# Altium project Hydrogen Bike BMS (100V).PrjPcb (part 2 of 3)

## Sheet AFE.SchDoc
size A; SheetNumber: 5; SheetTotal: 9
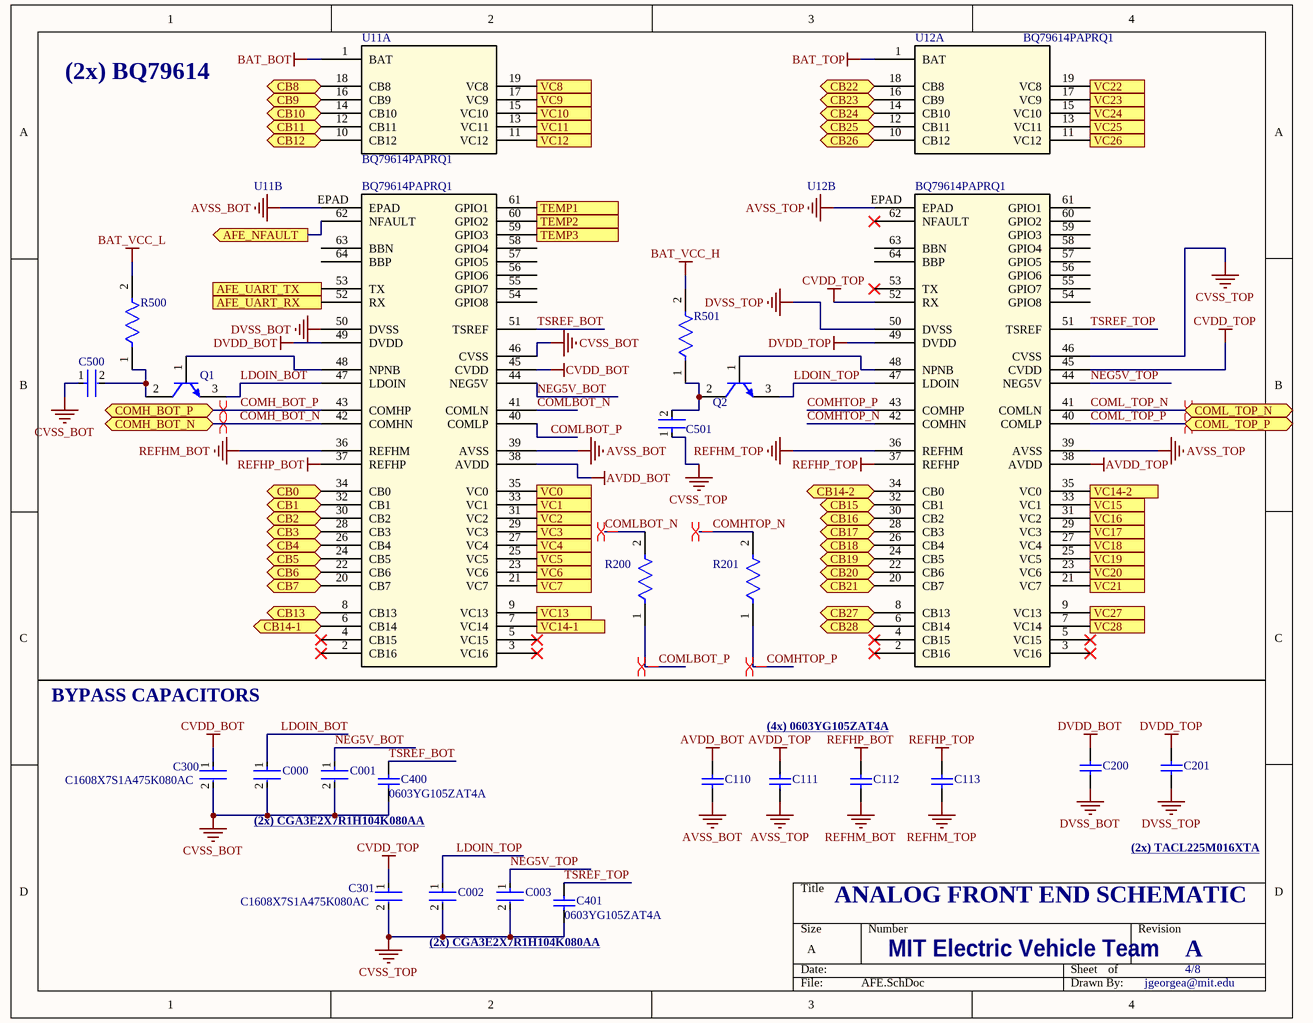
[diagram p4: AFE.SchDoc]

### Parts
C000  CGA3E2X7R1H104K080AA  [FP-CGA3E-0_3-0_1-IPC_A]  (value not drawn)
C001  CGA3E2X7R1H104K080AA  [FP-CGA3E-0_3-0_1-IPC_A]  (value not drawn)
C002  CGA3E2X7R1H104K080AA  [FP-CGA3E-0_3-0_1-IPC_A]  (value not drawn)
C003  CGA3E2X7R1H104K080AA  [FP-CGA3E-0_3-0_1-IPC_A]  (value not drawn)
C110  0603YG105ZAT4A  [CAPC1608X90X35ML15T15]  (value not drawn)
C111  0603YG105ZAT4A  [CAPC1608X90X35ML15T15]  (value not drawn)
C112  0603YG105ZAT4A  [CAPC1608X90X35ML15T15]  (value not drawn)
C113  0603YG105ZAT4A  [CAPC1608X90X35ML15T15]  (value not drawn)
C200  TACL225M016XTA  [CAPC1609X100X15ML20]  (value not drawn)
C201  TACL225M016XTA  [CAPC1609X100X15ML20]  (value not drawn)
C300  C1608X7S1A475K080AC  [FP-C1608-080-MFG]
C301  C1608X7S1A475K080AC  [FP-C1608-080-MFG]
C400  0603YG105ZAT4A  [CAPC1608X90X35ML15T15]
C401  0603YG105ZAT4A  [CAPC1608X90X35ML15T15]
C500  C0805C224J1RACTU  [FP-C0805C-DN-MFG]  (value not drawn)
C501  C0805C224J1RACTU  [FP-C0805C-DN-MFG]  (value not drawn)
Q1  2SC3646T-TD-E  [ONSC-SOT-89_PCP-1-3-419AU_V]  (value not drawn)
Q2  2SC3646T-TD-E  [ONSC-SOT-89_PCP-1-3-419AU_V]  (value not drawn)
R200  RC1608J102CS  [FP-RC1608-IPC_A]  (value not drawn)
R201  RC1608J102CS  [FP-RC1608-IPC_A]  (value not drawn)
R500  PCAN1206E1500BST5  [FP-PCAN1206-MFG]  (value not drawn)
R501  PCAN1206E1500BST5  [FP-PCAN1206-MFG]  (value not drawn)
U11  BQ79614PAPRQ1  [QFP_4PAPRQ1_TEX]  (parts A,B of 2)
U12  BQ79614PAPRQ1  [QFP_4PAPRQ1_TEX]  (parts A,B of 2)

### Ports
AFE_NFAULT (out, see BMS_top_level[2C], Communication[1C]), AFE_UART_RX (in, see BMS_top_level[2C], Communication[1C]), AFE_UART_TX (out, see BMS_top_level[2C], Communication[1B]), CB0 (bidir, see BMS_top_level[2A], Cell_Balancing[2A]), CB1 (bidir, see BMS_top_level[2A], Cell_Balancing[2A]), CB2 (bidir, see BMS_top_level[2A], Cell_Balancing[2A]), CB3 (bidir, see BMS_top_level[2A], Cell_Balancing[2B]), CB4 (bidir, see BMS_top_level[2A], Cell_Balancing[2B]), CB5 (bidir, see BMS_top_level[2A], Cell_Balancing[2B]), CB6 (bidir, see BMS_top_level[2A], Cell_Balancing[2C]), CB7 (bidir, see BMS_top_level[2A], Cell_Balancing[2C]), CB8 (bidir, see BMS_top_level[2A], Cell_Balancing[2C]), CB9 (bidir, see BMS_top_level[2A], Cell_Balancing[2D]), CB10 (bidir, see BMS_top_level[2A], Cell_Balancing[2D]), CB11 (bidir, see BMS_top_level[2A], Cell_Balancing[3A]), CB12 (bidir, see BMS_top_level[2A], Cell_Balancing[3A]), CB13 (bidir, see BMS_top_level[2A], Cell_Balancing[3A]), CB14-1 (bidir, see BMS_top_level[2B], Cell_Balancing[3B]), CB14-2 (bidir, see BMS_top_level[2B], Cell_Balancing[3B]), CB15 (bidir, see BMS_top_level[2B], Cell_Balancing[3B]), CB16 (bidir, see BMS_top_level[2B], Cell_Balancing[3C]), CB17 (bidir, see BMS_top_level[2B], Cell_Balancing[3C]), CB18 (bidir, see BMS_top_level[2B], Cell_Balancing[3C]), CB19 (bidir, see BMS_top_level[2B], Cell_Balancing[3D]), CB20 (bidir, see BMS_top_level[2B], Cell_Balancing[3D]), CB21 (bidir, see BMS_top_level[2B], Cell_Balancing[4A]), CB22 (bidir, see BMS_top_level[2B], Cell_Balancing[4A]), CB23 (bidir, see BMS_top_level[2B], Cell_Balancing[4A]), CB24 (bidir, see BMS_top_level[2B], Cell_Balancing[4B]), CB25 (bidir, see BMS_top_level[2B], Cell_Balancing[4B]), CB26 (bidir, see BMS_top_level[2B], Cell_Balancing[4B]), CB27 (bidir, see BMS_top_level[2B], Cell_Balancing[4C]), CB28 (bidir, see BMS_top_level[2B], Cell_Balancing[4C]), COMH_BOT_N (bidir, see BMS_top_level[2C], Communication[1B]), COMH_BOT_P (bidir, see BMS_top_level[2C], Communication[1A]), COML_TOP_N (bidir, see BMS_top_level[2C], Communication[3B]), COML_TOP_P (bidir, see BMS_top_level[2C], Communication[3A]), TEMP1 (in, see BMS_top_level[2B], Connectors#1[1C]), TEMP2 (in, see BMS_top_level[2B], Connectors#1[1C]), TEMP3 (in, see BMS_top_level[2B], Connectors#1[1C]), VC0 (in, see BMS_top_level[2C], Voltage_Sensing[1A]), VC1 (in, see BMS_top_level[2C], Voltage_Sensing[1A]), VC2 (in, see BMS_top_level[2C], Voltage_Sensing[1A]), VC3 (in, see BMS_top_level[2C], Voltage_Sensing[1B]), VC4 (in, see BMS_top_level[2C], Voltage_Sensing[1B]), VC5 (in, see BMS_top_level[2C], Voltage_Sensing[1B]), VC6 (in, see BMS_top_level[2C], Voltage_Sensing[1C]), VC7 (in, see BMS_top_level[2C], Voltage_Sensing[1C]), VC8 (in, see BMS_top_level[2C], Voltage_Sensing[1C]), VC9 (in, see BMS_top_level[2C], Voltage_Sensing[1D]), VC10 (in, see BMS_top_level[2C], Voltage_Sensing[1D]), VC11 (in, see BMS_top_level[2C], Voltage_Sensing[3A]), VC12 (in, see BMS_top_level[2C], Voltage_Sensing[3A]), VC13 (in, see BMS_top_level[2C], Voltage_Sensing[3A]), VC14-1 (in, see BMS_top_level[2C], Voltage_Sensing[3B]), VC14-2 (in, see BMS_top_level[2C], Voltage_Sensing[3B]), VC15 (in, see BMS_top_level[2D], Voltage_Sensing[3B]), VC16 (in, see BMS_top_level[2D], Voltage_Sensing[3C]), VC17 (in, see BMS_top_level[2D], Voltage_Sensing[3C]), VC18 (in, see BMS_top_level[2D], Voltage_Sensing[3C]), VC19 (in, see BMS_top_level[2D], Voltage_Sensing[3D]), VC20 (in, see BMS_top_level[2D], Voltage_Sensing[3D]), VC21 (in, see BMS_top_level[2D], Voltage_Sensing[4A]), VC22 (in, see BMS_top_level[2D], Voltage_Sensing[4A]), VC23 (in, see BMS_top_level[2D], Voltage_Sensing[4A]), VC24 (in, see BMS_top_level[2D], Voltage_Sensing[4B]), VC25 (in, see BMS_top_level[2D], Voltage_Sensing[4B]), VC26 (in, see BMS_top_level[2D], Voltage_Sensing[4B]), VC27 (in, see BMS_top_level[2D], Voltage_Sensing[4C]), VC28 (in, see BMS_top_level[2D], Voltage_Sensing[4C])

### Nets
AVDD_BOT: C110.2 U11.38(AVDD)
AVDD_TOP: C111.2 U12.38(AVDD)
AVSS_BOT: C000.2 C001.2 C110.1 C112.1 C200.2 C300.2 C400.1 C500.1 U11.36(REFHM) U11.39(AVSS) U11.46(CVSS) U11.50(DVSS) U11.EPAD  [also labelled CVSS_BOT, DVSS_BOT, REFHM_BOT]
AVSS_TOP: C002.2 C003.2 C111.1 C113.1 C201.2 C301.2 C401.1 C501.1 U12.36(REFHM) U12.39(AVSS) U12.46(CVSS) U12.50(DVSS) U12.EPAD  [also labelled CVSS_TOP, DVSS_TOP, REFHM_TOP]
BAT_BOT: U11.1(BAT)
BAT_TOP: U12.1(BAT)
BAT_VCC_H: R501.2
BAT_VCC_L: R500.2
CVDD_BOT: C300.1 U11.45(CVDD)
CVDD_TOP: C301.1 U12.45(CVDD) U12.52(RX)
DVDD_BOT: C200.1 U11.49(DVDD)
DVDD_TOP: C201.1 U12.49(DVDD)
REFHP_BOT: C112.2 U11.37(REFHP)
REFHP_TOP: C113.2 U12.37(REFHP)
AFE_NFAULT: U11.62(NFAULT) ; port AFE_NFAULT
AFE_UART_N: U11.52(RX) ; port AFE_UART_RX
AFE_UART_P: U11.53(TX) ; port AFE_UART_TX
CB11: U11.12(CB11) ; port CB11
CB21: U12.20(CB7) ; port CB21
COMH_BOT_N: U11.42(COMHN) ; port COMH_BOT_N
COMH_BOT_P: U11.43(COMHP) ; port COMH_BOT_P
COMHTOP_N: R201.2 U12.42(COMHN)
COMHTOP_P: R201.1 U12.43(COMHP)
COML_TOP_N: U12.41(COMLN) ; port COML_TOP_N
COML_TOP_P: U12.40(COMLP) ; port COML_TOP_P
COMLBOT_N: R200.2 U11.41(COMLN)
COMLBOT_P: R200.1 U11.40(COMLP)
LDOIN_BOT: C000.1 Q1.3(E) U11.47(LDOIN)
LDOIN_TOP: C002.1 Q2.3(E) U12.47(LDOIN)
NEG5V_BOT: C001.1 U11.44(NEG5V)
NEG5V_TOP: C003.1 U12.44(NEG5V)
TSREF_BOT: C400.2 U11.51(TSREF)
TSREF_TOP: C401.2 U12.51(TSREF)
VC11: U11.13(VC11) ; port VC11
VC21: U12.21(VC7) ; port VC21
NetC21_1: U11.32(CB1) ; port CB1
NetC21_2: U11.34(CB0) ; port CB0
NetC22_1: U11.30(CB2) ; port CB2
NetC23_1: U11.28(CB3) ; port CB3
NetC24_1: U11.26(CB4) ; port CB4
NetC25_1: U11.24(CB5) ; port CB5
NetC26_1: U11.22(CB6) ; port CB6
NetC27_1: U11.20(CB7) ; port CB7
NetC28_1: U11.18(CB8) ; port CB8
NetC29_1: U11.16(CB9) ; port CB9
NetC30_1: U11.14(CB10) ; port CB10
NetC32_1: U11.10(CB12) ; port CB12
NetC33_1: U11.8(CB13) ; port CB13
NetC34_1: U11.6(CB14) ; port CB14-1
NetC61_1: U12.32(CB1) ; port CB15
NetC61_2: U12.34(CB0) ; port CB14-2
NetC62_1: U12.30(CB2) ; port CB16
NetC63_1: U12.28(CB3) ; port CB17
NetC64_1: U12.26(CB4) ; port CB18
NetC65_1: U12.24(CB5) ; port CB19
NetC66_1: U12.22(CB6) ; port CB20
NetC68_1: U12.18(CB8) ; port CB22
NetC70_1: U12.16(CB9) ; port CB23
NetC71_1: U12.14(CB10) ; port CB24
NetC72_1: U12.12(CB11) ; port CB25
NetC73_1: U12.10(CB12) ; port CB26
NetC74_1: U12.8(CB13) ; port CB27
NetC75_1: U12.6(CB14) ; port CB28
NetC80_1: U11.35(VC0) ; port VC0
NetC81_1: U11.33(VC1) ; port VC1
NetC82_1: U11.31(VC2) ; port VC2
NetC83_1: U11.29(VC3) ; port VC3
NetC84_1: U11.27(VC4) ; port VC4
NetC85_1: U11.25(VC5) ; port VC5
NetC86_1: U11.23(VC6) ; port VC6
NetC87_1: U11.21(VC7) ; port VC7
NetC88_1: U11.19(VC8) ; port VC8
NetC89_1: U11.17(VC9) ; port VC9
NetC90_1: U11.15(VC10) ; port VC10
NetC92_1: U11.11(VC12) ; port VC12
NetC93_1: U11.9(VC13) ; port VC13
NetC94_1: U11.7(VC14) ; port VC14-1
NetC95_1: U12.35(VC0) ; port VC14-2
NetC96_1: U12.33(VC1) ; port VC15
NetC97_1: U12.31(VC2) ; port VC16
NetC98_1: U12.29(VC3) ; port VC17
NetC99_1: U12.27(VC4) ; port VC18
NetC100_1: U12.25(VC5) ; port VC19
NetC101_1: U12.23(VC6) ; port VC20
NetC103_1: U12.19(VC8) ; port VC22
NetC104_1: U12.17(VC9) ; port VC23
NetC105_1: U12.15(VC10) ; port VC24
NetC106_1: U12.13(VC11) ; port VC25
NetC107_1: U12.11(VC12) ; port VC26
NetC108_1: U12.9(VC13) ; port VC27
NetC109_1: U12.7(VC14) ; port VC28
NetC500_2: C500.2 Q1.2(C) R500.1
NetC501_2: C501.2 Q2.2(C) R501.1
NetP1_1: U11.61(GPIO1) ; port TEMP1
NetP1_2: U11.60(GPIO2) ; port TEMP2
NetP1_3: U11.59(GPIO3) ; port TEMP3
NetQ1_1: Q1.1(B) U11.48(NPNB)
NetQ2_1: Q2.1(B) U12.48(NPNB)

Not connected (* = marked no-connect by the designer): U11 2(CB16)* 3(VC16)* 4(CB15)* 5(VC15)* 54(GPIO8) 55(GPIO7) 56(GPIO6) 57(GPIO5) 58(GPIO4) 63(BBN) 64(BBP); U12 2(CB16)* 3(VC16)* 4(CB15)* 5(VC15)* 53(TX)* 54(GPIO8) 55(GPIO7) 56(GPIO6) 57(GPIO5) 58(GPIO4) 59(GPIO3) 60(GPIO2) 61(GPIO1) 62(NFAULT)* 63(BBN) 64(BBP)

### Layout directives
differential pair: COMH_BOT_N, COMH_BOT_P, COMHTOP_N, COMHTOP_P, COML_TOP_N, COML_TOP_P, COMLBOT_N, COMLBOT_P

### Notes on the sheet
- (2x) BQ79614
- BYPASS CAPACITORS
- (4x) 0603YG105ZAT4A
- (2x) CGA3E2X7R1H104K080AA
- ANALOG FRONT END SCHEMATIC
- (2x) TACL225M016XTA
- MIT Electric Vehicle Team
- A
- 4/8
- jgeorgea@mit.edu

### Library data of the parts
C000 C001 C002 C003 = CMP-2000-07546-2: as C41 on sheet Communication; Weight: 7.1E-05oz; Composition: Ceramic; Max Operating Temperature: 125°C; Termination: SMD/SMT; Dielectric: X7R; Length: 1.6mm; Package Quantity: 1; REACH SVHC: No SVHC; Lead Free: Lead Free; Case Code (Metric): 1608; Min Operating Temperature: -55°C; Packaging: Tape and Reel; Tolerance: 10%; Voltage Rating: 50V; Case Code (Imperial): 0603; Capacitance: 100nF; Case/Package: 0603; Voltage Rating (DC): 50V; Depth: 0.8mm; Radiation Hardening: No; Ratings: AEC-Q200; Mount: Surface Mount; Voltage: 50V; Thickness: 0.035inch; Width: 0.8mm; Height: 0.8mm
C110-C113 C400 C401 = CMP-2006-04543-1: Manufacturer: AVX Interconnect / Elco; Part Number: 0603YG105ZAT4A
C200 C201 = CMP-2006-00199-1: Manufacturer: AVX Interconnect / Elco; Part Number: TACL225M016XTA
C300 C301 = CMP-08246-005491-1: CAP CER 4.7UF 10V X7S 0603; Dielectric Material: Ceramic; Interface: I2C; Frequency: 48MHz; Memory Type: FLASH; Peripherals: Brown-out Detect/Reset; Tolerance: 10%; Oscillator Type: Internal; Number of I/Os: 53; Core Architecture: ARM; Memory Size: 64KB; Voltage Rating: 10V; Lead Free: Lead Free; Case Code (Imperial): 0603; Voltage Rating (DC): 10V; Series: Leopard Gecko; Min Operating Temperature: -40°C; Case/Package: LFBGA; Dielectric: X7S; RoHS Compliant: Yes; Package Quantity: 1000; Capacitance: 4.7uF; Thickness: 800um; Number of Pins: 64; REACH SVHC: No SVHC; Length: 1.6mm; Max Operating Temperature: 125°C; Depth: 0.8mm; Packaging: Tape and Reel; Case Code (Metric): 1608
C500 C501 = CMP-1036-04559-3: CAP CER 0.22UF 100V 5% X7R 0805; Manufacturer: KEMET; Tolerance: 0.05; Value: 0.22 μF; Temperature Coefficient: 30ppm/°C; Material: Ceramic; ComponentLink2URL: https://content.kemet.com/datasheets/KEM_C1003_C0G_SMD.pdf; Voltage Rating: 100 V; Temperature Range High: +125°C; Ipc Land Pattern Name: CAPC200125X78; Device Class L2: Capacitors; Temperature Range Low: -55°C; Automotive: No; RoHS: TRUE; ComponentLink2Description: Datasheet; Digikey Description: CAP CER 0.22UF 100V 5% X7R 0805; Category: Cap; Package: C0805C-DN; Temperature: -55°C to +125°C; Capacitance: 0.22 μF; Mouser Description: Multilayer Ceramic Capacitors MLCC - SMD/SMT 100volts 0.22uF X7R 5%; Temperature Characteristic: X7R; Device Class L1: Passive Components; Height: 0.88mm; Device Class L3: Ceramic Capacitors; Lead Free: Yes; Manufacturer Part Number: C0805C224J1RACTU; Octopart: https://octopart.com/c0805c224j1ractu-kemet-17138221
Q1 Q2 = CMP-1048-00948-1: Bipolar Transistor, 100 V, 1 A, Low VCE(sat), NPN Single, 3-Pin SOT-89, Pb-Free, Tape and Reel; Manufacturer: On Semiconductor; IC Continuous (A): 1; PartNumber: 2SC3646T-TD-E; RoHS: TRUE; Packing: Tape and Reel; ComponentLink2URL: http://www.onsemi.com/pub_link/Collateral/EN2005-D.PDF; ComponentLink3URL: http://www.onsemi.com/pub_link/Collateral/ENA1087-D.PDF; PackageReference: SOT-89_PCP-1-3-419AU; Mounting Technology: Surface Mount; ComponentLink1Description: Manufacturer URL; ComponentLink3Description: Package Specification; ComponentLink1URL: http://www.onsemi.com/; PackageDescription: 3-Pin Small Outline Transistor, Body 4.5 x 2.5 mm, Pitch 1.5 mm; Polarity: NPN; PackageVersion: Rev. O, 04/2012; ComponentLink2Description: Datasheet
R200 R201 = CMP-13261-002301-1: Res Thick Film 0603 1kΩ 5% 0.1W ±100ppm/°C Molded SMD T/R; Power Rating: 100mW; Resistance: 1kR; Voltage Rating (DC): 50V; Contact Plating: Tin; Mount: Surface Mount; Number of Terminations: 2; Features: Moisture Resistant; Max Power Dissipation: 100mW; Military Standard: Not; Case/Package: 0603; Radiation Hardening: No; Temperature Coefficient: 100ppm/°C; Length: 1.6mm; Height: 0.022inch; Case Code (Metric): 1608; Max Operating Temperature: 155°C; Composition: Thick Film; Tolerance: 5%; Width: 0.031inch; Depth: 0.8mm; Packaging: Tape and Reel; Lead Free: Lead Free; Case Code (Imperial): 0603; Min Operating Temperature: -55°C
R500 R501 = CMP-02407-000005-1: RES SMD 150 OHM 0.1% 2W 1206; Manufacturer: Vishay; Value: 150Ω; Temperature Coefficient: 25ppm/°C; Power Rating: 2000mW; Voltage Rating: 100V; Category: Res; Lead Free: Yes; Manufacturer Part Number: PCAN1206E1500BST5; Digikey Description: RES SMD 150 OHM 0.1% 2W 1206; Device Class L2: Resistors; Ipc Land Pattern Name: RESC320160X38; Package: PCAN1206; Tolerance: 0.1%; Temperature Range High: +155°C; Resistance: 150Ω; Composition: Thin Film; Series: PCAN; ComponentLink2URL: https://www.vishay.com/docs/60125/pcan.pdf; Octopart: https://octopart.com/pcan1206e1500bst5-vishay-47198091; RoHS: TRUE; Height: 0.018inch; Temperature Range Low: -55°C; Temperature: -55°C to +155°C; Device Class L1: Passive Components; Automotive: No; Device Class L3: Chip SMD Resistors; ComponentLink2Description: Datasheet
U11 U12 = BQ79614PAPRQ1: No Description Available; Mfr_Name: Texas Instruments; RefDes: RefDes; Type: Type

## Sheet Power.SchDoc
size A; SheetNumber: 4; SheetTotal: 9
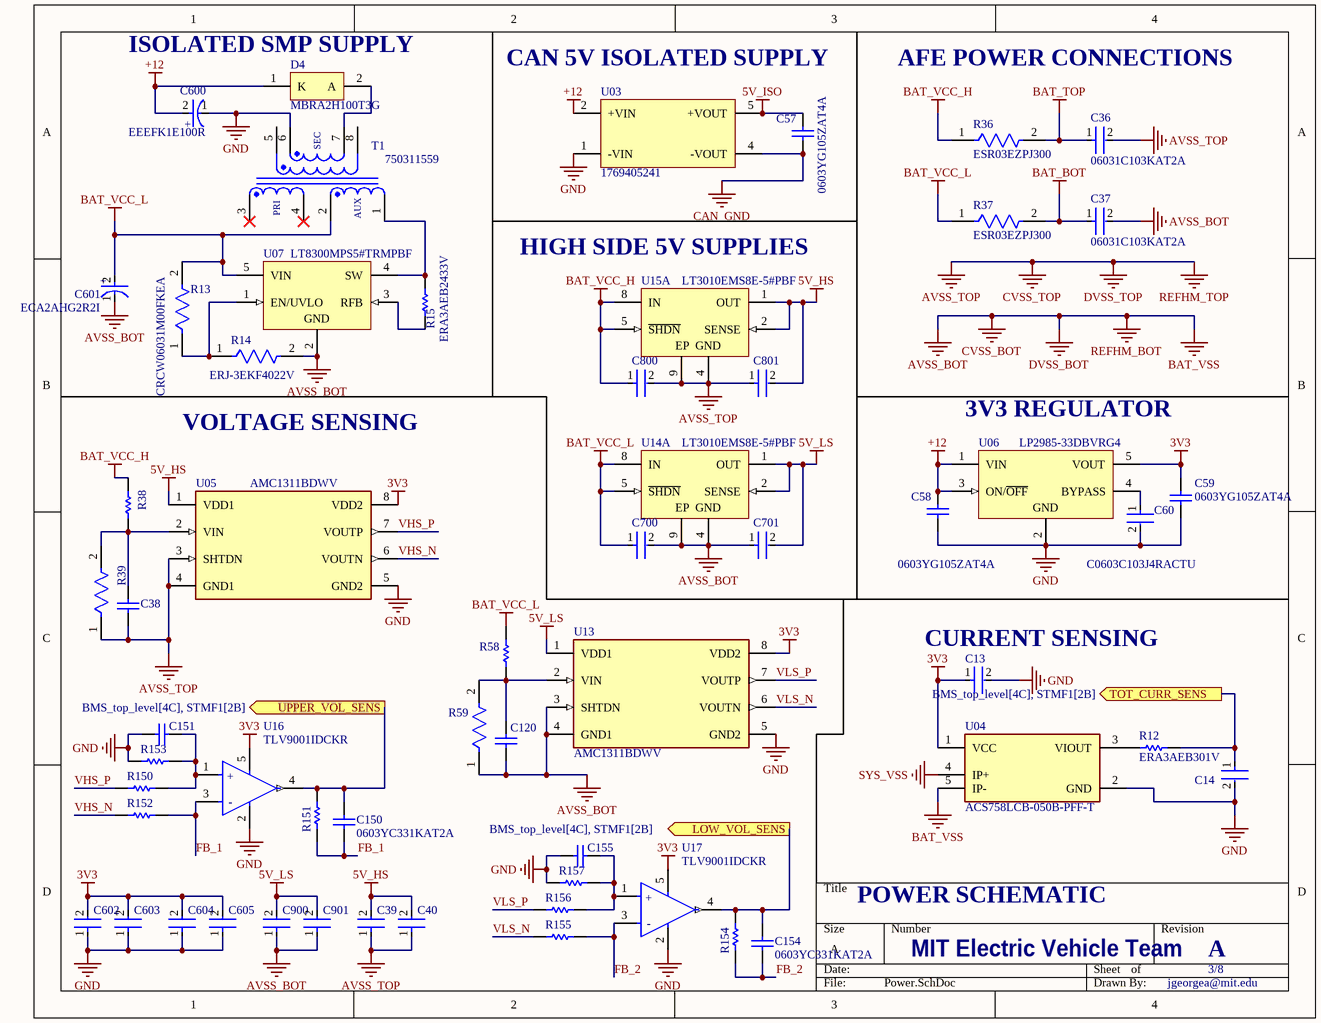
[diagram p5: Power.SchDoc]

### Parts
C13  CGA3E2X7R1H104K080AA  [FP-CGA3E-0_3-0_1-IPC_A]  (value not drawn)
C14  CGA3E2X7R1H104K080AA  [FP-CGA3E-0_3-0_1-IPC_A]  (value not drawn)
C36  06031C103KAT2A  [FP-0603-L_1_6_0_15-W_0_81-IPC_C]
C37  06031C103KAT2A  [FP-0603-L_1_6_0_15-W_0_81-IPC_C]
C38  CC0603JRNPO9BN101  [CAPC1608X90X40ML10T20]  (value not drawn)
C39  C2012X7S2A105K125AE  [FP-C2012-125-IPC_B]  (value not drawn)
C40  CGA3E2X7R1H104K080AA  [FP-CGA3E-0_3-0_1-IPC_A]  (value not drawn)
C57  0603YG105ZAT4A  [CAPC1608X90X35ML15T15]
C58  0603YG105ZAT4A  [CAPC1608X90X35ML15T15]
C59  0603YG105ZAT4A  [CAPC1608X90X35ML15T15]
C60  C0603C103J4RACTU  [FP-C0603C-CF-MFG]
C120  CC0603JRNPO9BN101  [CAPC1608X90X40ML10T20]  (value not drawn)
C150  0603YC331KAT2A  [CAPC1608X90X35ML15T15]
C151  0603YC331KAT2A  [CAPC1608X90X35ML15T15]  (value not drawn)
C154  0603YC331KAT2A  [CAPC1608X90X35ML15T15]
C155  0603YC331KAT2A  [CAPC1608X90X35ML15T15]  (value not drawn)
C600  EEEFK1E100R  [FP-FKB-MFG]
C601  ECA2AHG2R2I  [FP-RAD-TH-D_5_0_5-L_11_1-MFG]
C602  C2012X7S2A105K125AE  [FP-C2012-125-IPC_B]  (value not drawn)
C603  C2012X7S2A105K125AE  [FP-C2012-125-IPC_B]  (value not drawn)
C604  CGA3E2X7R1H104K080AA  [FP-CGA3E-0_3-0_1-IPC_A]  (value not drawn)
C605  CGA3E2X7R1H104K080AA  [FP-CGA3E-0_3-0_1-IPC_A]  (value not drawn)
C700  C2012X7S2A105K125AE  [FP-C2012-125-IPC_B]  (value not drawn)
C701  C2012X7S2A105K125AE  [FP-C2012-125-IPC_B]  (value not drawn)
C800  C2012X7S2A105K125AE  [FP-C2012-125-IPC_B]  (value not drawn)
C801  C2012X7S2A105K125AE  [FP-C2012-125-IPC_B]  (value not drawn)
C900  C2012X7S2A105K125AE  [FP-C2012-125-IPC_B]  (value not drawn)
C901  CGA3E2X7R1H104K080AA  [FP-CGA3E-0_3-0_1-IPC_A]  (value not drawn)
D4  MBRA2H100T3G  [ONSC-SMA-2-403D-02_V]
R12  ERA3AEB301V  [RESC1608X55X30LL20T20]
R13  CRCW06031M00FKEA  [FP-CRCW0603-e3-MFG]
R14  ERJ-3EKF4022V  [FP-ERJ3EK-IPC_C]
R15  ERA3AEB2433V  [RESC1608X55X30NL20T20]
R36  ESR03EZPJ300  [FP-ESR03-MFG]
R37  ESR03EZPJ300  [FP-ESR03-MFG]
R38  ERJ-3GEYJ245V  [RESC1608X55X30ML15T15]  (value not drawn)
R39  RT0603FRE0739K2L  [FP-RT0603-MFG]  (value not drawn)
R58  ERJ-3GEYJ245V  [RESC1608X55X30ML15T15]  (value not drawn)
R59  RT0603FRE0739K2L  [FP-RT0603-MFG]  (value not drawn)
R150  ERJ-3EKF3301V  [RESC1609X55X30ML15T15]  (value not drawn)
R151  ERJ-3EKF3301V  [RESC1609X55X30ML15T15]  (value not drawn)
R152  ERJ-3EKF3301V  [RESC1609X55X30ML15T15]  (value not drawn)
R153  ERJ-3EKF3301V  [RESC1609X55X30ML15T15]  (value not drawn)
R154  ERJ-3EKF3301V  [RESC1609X55X30ML15T15]  (value not drawn)
R155  ERJ-3EKF3301V  [RESC1609X55X30ML15T15]  (value not drawn)
R156  ERJ-3EKF3301V  [RESC1609X55X30ML15T15]  (value not drawn)
R157  ERJ-3EKF3301V  [RESC1609X55X30ML15T15]  (value not drawn)
T1  750311559  [WE-FLYLT_EP7_L9.78W9.50H10.54]
U03  1769405241  [WPME-FISM_SMT-8_L13.2W11.4H7.25]
U04  ACS758LCB-050B-PFF-T  [FP-CB-5-PFF-MFG]
U05  AMC1311BDWV  [FP-DWV0008A-MFG]
U06  LP2985-33DBVRG4  [DBV0005A_M]
U07  LT8300MPS5#TRMPBF  [LT-S5-5-TSOT-23_N]
U13  AMC1311BDWV  [FP-DWV0008A-MFG]
U14  LT3010EMS8E-5#PBF  [LT-MS8E-8-1880X1680TP_L]  (part A of 2)
U15  LT3010EMS8E-5#PBF  [LT-MS8E-8-1880X1680TP_L]  (part A of 2)
U16  TLV9001IDCKR  [FP-DCK0005A-MFG]
U17  TLV9001IDCKR  [FP-DCK0005A-MFG]

### Ports
LOW_VOL_SENS (out, see BMS_top_level[4C], STMF1[2B]), TOT_CURR_SENS (out, see BMS_top_level[4C], STMF1[2B]), UPPER_VOL_SENS (out, see BMS_top_level[4C], STMF1[2B])

### Nets
3V3: C13.1 C59.2 C602.2 C603.2 C604.2 C605.2 U04.1(VCC) U05.8(VDD2) U06.5(VOUT) U13.8(VDD2) U16.5(V+) U17.5(V+)
5V_HS: C39.2 C40.2 C801.2 U05.1(VDD1) U15.1(OUT) U15.2(SENSE)
5V_ISO: C57.2 U03.5(+VOUT)
5V_LS: C701.2 C900.2 C901.2 U13.1(VDD1) U14.1(OUT) U14.2(SENSE)
+12: C58.2 C600.2(A) D4.1(K) U03.2(+VIN) U06.1(VIN) U06.3(ON/~{OFF})
AVSS_BOT: C37.2 C120.1 C601.1(C) C700.2 C701.1 C900.1 C901.1 R14.2 R59.1 U04.5(IP-) U07.2(GND) U13.3(SHTDN) U13.4(GND1) U14.4(GND) U14.9(EP)  [also labelled BAT_VSS, CVSS_BOT, DVSS_BOT, REFHM_BOT]
AVSS_TOP: C36.2 C38.1 C39.1 C40.1 C800.2 C801.1 R39.1 U05.3(SHTDN) U05.4(GND1) U15.4(GND) U15.9(EP)  [also labelled CVSS_TOP, DVSS_TOP, REFHM_TOP]
BAT_BOT: C37.1 R37.2
BAT_TOP: C36.1 R36.2
BAT_VCC_H: C800.1 R36.1 R38.2 U15.5(~{SHDN}) U15.8(IN)
BAT_VCC_L: C601.2(A) C700.1 R13.2 R37.1 R58.2 T1.2 U07.5(VIN) U14.5(~{SHDN}) U14.8(IN)
CAN_GND: C57.1 U03.4(-VOUT)
GND: C13.2 C14.2 C58.1 C59.1 C60.2 C151.1 C155.1 C600.1(C) C602.1 C603.1 C604.1 C605.1 R153.2 R157.2 T1.6 U03.1(-VIN) U04.2(GND) U05.5(GND2) U06.2(GND) U13.5(GND2) U16.2(V-) U17.2(V-)
SYS_VSS: U04.4(IP+)
FB_1: C150.1 R151.1 R152.1 U16.3(IN-)
FB_2: C154.1 R154.1 R155.1 U17.3(IN-)
LOW_VOL: C154.2 R154.2 U17.4(OUT) ; port LOW_VOL_SENS
TOT_CURR: C14.1 R12.2 ; port TOT_CURR_SENS
UPPER_VOL: C150.2 R151.2 U16.4(OUT) ; port UPPER_VOL_SENS
VHS_N: R152.2 U05.6(VOUTN)
VHS_P: R150.2 U05.7(VOUTP)
VLS_N: R155.2 U13.6(VOUTN)
VLS_P: R156.2 U13.7(VOUTP)
NetC38_2: C38.2 R38.1 R39.2 U05.2(VIN)
NetC60_1: C60.1 U06.4(BYPASS)
NetC120_2: C120.2 R58.1 R59.2 U13.2(VIN)
NetC151_2: C151.2 R150.1 R153.1 U16.1(IN+)
NetC155_2: C155.2 R156.1 R157.1 U17.1(IN+)
NetD4_2: D4.2(A) T1.7
NetR12_1: R12.1 U04.3(VIOUT)
NetR13_1: R13.1 R14.1 U07.1(EN/UVLO)
NetR15_1: R15.1 U07.3(RFB)
NetR15_2: R15.2 T1.1 U07.4(SW)

Not connected (* = marked no-connect by the designer): T1 3* 4* 5 8

### Notes on the sheet
- (near D4) ISOLATED SMP SUPPLY
- CAN 5V ISOLATED SUPPLY
- AFE POWER CONNECTIONS
- (near U15) HIGH SIDE 5V SUPPLIES
- VOLTAGE SENSING
- (near U06) 3V3 REGULATOR
- (near C13) CURRENT SENSING
- POWER SCHEMATIC
- MIT Electric Vehicle Team
- A
- 3/8
- jgeorgea@mit.edu
- (in symbol CMP-03913-24618066-1) SEC; PRI; AUX
- (in symbol CMP-04895-000186-1) +; -
- (in symbol CMP-05427-000055-1) +
- (in symbol CMP-05427-001174-1) +

### Library data of the parts
C13 C14 C40 C604 C605 C901 = CMP-2000-07546-2: Cap Ceramic 100nF 50V X7R 10% Pad SMD 0603 +125°C Automotive T/R; Weight: 7.1E-05oz; Composition: Ceramic; Max Operating Temperature: 125°C; Termination: SMD/SMT; Dielectric: X7R; Length: 1.6mm; Package Quantity: 1; REACH SVHC: No SVHC; Lead Free: Lead Free; Case Code (Metric): 1608; Min Operating Temperature: -55°C; Packaging: Tape and Reel; Tolerance: 10%; Voltage Rating: 50V; Case Code (Imperial): 0603; Capacitance: 100nF; Case/Package: 0603; Voltage Rating (DC): 50V; Depth: 0.8mm; Radiation Hardening: No; Ratings: AEC-Q200; Mount: Surface Mount; Voltage: 50V; Thickness: 0.035inch; Width: 0.8mm; Height: 0.8mm
C36 C37 = CMP-2006-04074-2: General Purpose Ceramic Capacitor, 0603, 10nF, 10%, X7R, 15%, 100V; Dissipation Factor: 2.5%; Insulation Resistance: 100GR; Voltage: 100V; Series: -; Case Code (Imperial): 0603; Mount: Surface Mount; Dielectric: X7R; Package Quantity: 1; Construction: Flat; Max Operating Temperature: 125°C; Tolerance: 10%; RoHS Compliant: Yes; Case/Package: 0603; Contact Plating: Tin; Height: 0.9mm; Voltage Rating: 100V; Depth: 0.81mm; Radiation Hardening: No; Termination: SMD/SMT; Case Code (Metric): 1608; Number of Pins: 2; Length: 1.6mm; Lead Free: Lead Free; Thickness: 0.035inch; Packaging: Tape and Reel; Capacitance: 10nF; Width: 0.032inch; Min Operating Temperature: -55°C; Voltage Rating (DC): 100V; REACH SVHC: No SVHC
C38 C120 = CMP-2100-03594-1: Chip Capacitor, 100 pF, +/- 5%, 50 V, -55 to 125 degC, 0603 (1608 Metric), RoHS, Tape and Reel; Manufacturer: Yageo; Capacitance: 100pF; Voltage Rating (DC): 50V; Dielectric: C0G; Temperature Coefficient: 30ppm/degC; Insulation Resistance: 100GR; Datasheet Version: Rev. 14, 07/2016; Manufacturer URL: http://www.yageo.com/; Packaging: TapeandReel; Mount: SurfaceMount; RoHSCompliant: True; Package Reference: 0603; Tolerance: 5%; Max Operating Temperature: 125degC; Case Code (Imperial): 0603; Number of Pins: 2; Width: 0.8mm; Case Code (Metric): 1608; Voltage: 50V; REACH SVHC: Unknown; Package Description: 2-Pin Surface Mount Device, Body 1.6 x 0.8 mm; Composition: Ceramic; Lead Free: LeadFree; Min Operating Temperature: -55degC; Radiation Hardening: No; Depth: 0.8mm; Thickness: 0.035inch; Datasheet URL: http://www.yageo.com/documents/recent/UPY-GP_NP0_16V-to-50V_14.pdf; Termination: SMD/SMT; Package Quantity: 1; Length: 1.6mm; Voltage Rating: 50V; Height: 0.8mm; Case/Package: 0603
C39 C602 C603 C700 C701 C800 C801 C900 = CMP-08246-004333-1: CAP CER 1UF 100V X7S 0805; Tolerance: 10%; Case Code (Metric): 2012; Resistor Type: Ceramic; Voltage Rating (DC): 100V; RoHS Compliant: Yes; Mount: Surface Mount; Min Operating Temperature: -55°C; Voltage Rating: 100V; Series: C; Width: 0.05inch; Max Operating Temperature: 125°C; Height: 1.25mm; Capacitance: 1uF; Length: 2mm; Dielectric: X7S; Case/Package: 0805; Packaging: Tape and Reel; Features: Soft Termination; Lead Free: Lead Free; Case Code (Imperial): 0805; Thickness: 0.049inch; Termination: SMD/SMT; Package Quantity: 1; Depth: 1.25mm
C57-C59 = CMP-2006-04543-1: Manufacturer: AVX Interconnect / Elco; Part Number: 0603YG105ZAT4A
C60 = CMP-2006-03033-2: CAP CER 10000PF 16V 5% X7R 0603; Manufacturer: KEMET; Value: 10,000 pF; Tolerance: 0.05; Material: Ceramic; Temperature Coefficient: 30ppm/°C; Automotive Grade: Grade 1; Height: 0.87mm; Temperature Range High: +125°C; Temperature Range Low: -55°C; Automotive: Yes; Package: C0603C-CF; Temperature Characteristic: X7R; RoHS: TRUE; Device Class L2: Capacitors; Device Class L3: Ceramic Capacitors; Device Class L1: Passive Components; Manufacturer Part Number: C0603C103J4RACTU; Voltage Rating: 16 V; ComponentLink2URL: https://api.kemet.com/component-edge/download/datasheet/C0603C100J5GACAUTO.pdf; ComponentLink2Description: Datasheet; Mouser Description: Multilayer Ceramic Capacitors MLCC - SMD/SMT 16volts 10000pF X7R 5%; Temperature: -55°C to +125°C; Digikey Description: CAP CER 10000PF 16V 5% X7R 0603; Octopart: https://octopart.com/c0603c103j4ractu-kemet-9139447; Capacitance: 10,000 pF; Category: Cap; Lead Free: Yes
C150 C151 C154 C155 = CMP-2006-04513-1: Manufacturer: AVX Interconnect / Elco; Part Number: 0603YC331KAT2A
C600 = CMP-05427-000055-1: CAP ALUM 10UF 20% 25V SMD; ESR (Equivalent Series Resistance): 1.35R; Life (Hours): 2000Hour; Dielectric Material: Aluminium; Leakage Current: 3uA; Ripple Current (AC): 90mA; Polarity: Polar; Voltage: 25V; Voltage Rating: 25V; Number of Pins: 2; Package Quantity: 1; Max Operating Temperature: 105°C; Tolerance: 20%; Voltage Rating (DC): 25V; Packaging: Tape and Reel; Impedance: 1.35R; Case/Package: Radial; Series: FK; Height - Seated (Max): 0.24inch; Diameter: 4mm; Length: 5.8mm; Construction: Cylindrical; Height: 5.8mm; Mount: Surface Mount; REACH SVHC: No SVHC; Termination: SMD/SMT; Capacitance: 10uF; Lead Free: Lead Free; RoHS Compliant: Yes; Contact Plating: Tin; Width: 5.5mm; Radiation Hardening: No; Min Operating Temperature: -55°C; Ripple Current: 90mA
C601 = CMP-05427-001174-1: Aluminum Electrolytic Capacitors (Radial Lead Type) AEC-Q200 Qualified 2.2uF ±20% 100V; Lead Diameter: 0.5mm; Life (Hours): 1000Hour; Lead/Base Style: Straight; Ripple Current: 21mA; Mount: Through Hole; Max Operating Temperature: 105°C; Length: 11mm; Voltage Rating (DC): 100V; Case/Package: Radial; Package Quantity: 2000; Lead Pitch: 2.5mm; Series: NHG; Min Operating Temperature: -55°C; Tolerance: 20%; Capacitance: 2.2uF; RoHS Compliant: Yes; Termination: Radial; Packaging: Ammo Pack; Height: 11mm; Diameter: 5mm; Radiation Hardening: No
D4 = CMP-1055-00325-1: Schottky Power Rectifier, 2-Pin SMA, Pb-Free, Tape and Reel; Manufacturer: On Semiconductor; IFSM Max (A): 130; Configuration: Single; PackageDescription: 2-Pin Small Molded Package, J-Bend Lead, Body 2.605 x 4.315 mm; ComponentLink2URL: http://www.onsemi.cn/pub_link/Collateral/MBRS2H100-D.PDF; RoHS: TRUE; ComponentLink3URL: http://www.onsemi.com/pub_link/Collateral/403D-02.PDF; PartNumber: MBRA2H100T3G; ComponentLink2Description: Datasheet; ComponentLink3Description: Package Specification; PackageReference: SMA-2-403D-02; ComponentLink1Description: Manufacturer URL; DatasheetVersion: Rev. 8; ComponentLink1URL: http://www.onsemi.com/; PackageVersion: Rev. G, 07/2012; Mounting Technology: Surface Mount; Packing: Tape and Reel
R12 = CMP-2000-00025-1: Manufacturer: Panasonic; Part Number: ERA3AEB301V
R13 = CMP-2000-03013-2: RES Thick Film, 1MΩ, 1%, 0.1W, 100ppm/°C, 0603; Max Power Dissipation: 100mW; Resistance: 1MR; Voltage Rating (DC): 75V; Depth: 0.85mm; Max Operating Temperature: 155°C; Length: 1.55mm; Power Rating: 100mW; Military Standard: Not; Features: Automotive AEC-Q200; Min Operating Temperature: -55°C; Number of Pins: 2; Mount: Surface Mount; Package Quantity: 10; Packaging: Tape and Reel; Height: 0.45mm; Radiation Hardening: No; Case Code (Metric): 1608; Temperature Coefficient: 100ppm/°C; Width: 0.85mm; Composition: Thick Film; Termination: SMD/SMT; Tolerance: 1%; Number of Terminations: 2; Lead Free: Lead Free; Contact Plating: Tin; Case/Package: 0603; Weight: 7.1E-05oz; Voltage Rating: 75V; Case Code (Imperial): 0603
R14 = CMP-2000-00486-2: RES SMD 40.2K OHM 1% 1/10W 0603; Power Rating: 100mW; Resistance: 40.2kR; Voltage Rating: 75V; Temperature Coefficient: 100ppm/°C; Voltage Rating (DC): 50V; Military Standard: Not; Lead Free: Lead Free; Resistor Type: Thick Film; Weight: 7.1E-05oz; Resistance Tolerance: 1%; Number of Terminations: 2; Min Operating Temperature: -55°C; Depth: 0.8mm; Max Power Dissipation: 100mW; Length: 1.6mm; Case Code (Imperial): 0603; Max Operating Temperature: 155°C; Series: ERJ; Radiation Hardening: No; Features: Automotive AEC-Q200; Mount: Surface Mount; Package Quantity: 1; Packaging: Tape and Reel; Height: 0.45mm; Width: 0.031inch; RoHS Compliant: Yes; Case/Package: 0603; Tolerance: 1%; Contact Plating: Tin; Technology: THICK FILM; Construction: Rectangular; Case Code (Metric): 1608; Termination: SMD/SMT
R15 = CMP-2000-00968-1: Manufacturer: Panasonic; Part Number: ERA3AEB2433V
R36 R37 = CMP-08839-029539-1: 30Ω ±5% 0.25W 0603 Anti-Surge Chip Resistor AEC-Q200; Temperature Coefficient: 200ppm/°C; Max Power Dissipation: 250mW; Resistance: 30R; Case Code (Imperial): 0603; Case Code (Metric): 1608; Height: 0.022inch; Number of Terminations: 2; Max Operating Temperature: 155°C; Length: 0.063inch; Package Quantity: 5000; Features: Automotive AEC-Q200; Tolerance: 5%; Width: 0.031inch; RoHS Compliant: Yes; Packaging: Tape and Reel; Min Operating Temperature: -55°C; Resistor Type: Thick Film; Case/Package: 0603; Series: ESR
R38 R58 = CMP-2000-00756-1: Manufacturer: Panasonic; Part Number: ERJ-3GEYJ245V
R39 R59 = CMP-2000-04739-2: RES SMD 39.2K OHM 1% 1/10W 0603; Manufacturer: Yageo; Temperature Coefficient: 50 ppm/°C; Resistance: 39.2KΩ; Tolerance: 0.01; Voltage Rating: 75V; Value: 39.2KΩ; Power Rating: 0.1W; ComponentLink2Description: Datasheet; Manufacturer Part Number: RT0603FRE0739K2L; Device Class L1: Passive Components; Temperature Range Low: -55°C; Package: RT0603; ComponentLink2URL: http://www.yageo.com/documents/recent/PYu-RT_1-to-0.01_RoHS_L_9.pdf; Device Class L2: Resistors; Octopart: https://octopart.com/rt0603fre0739k2l-yageo-1367269; Automotive: No; Digikey Description: RES SMD 39.2K OHM 1% 1/10W 0603; Temperature: -55°C to +155°C; Category: Res; Series: RT; RoHS: TRUE; Temperature Range High: +155°C; Device Class L3: Chip SMD Resistors; Composition: Thin Film; Height: 0.55mm; Footprint Url: http://www.yageo.com/exep/pages/download/literatures/PYu-R_Mount_10.pdf; Mouser Description: Thin Film Resistors - SMD 1/10W 39.2K ohm 1% 50ppm; Lead Free: Yes; Ipc Land Pattern Name: RESC16080X45
R150-R157 = CMP-2000-00436-2: Chip Resistors, 3.3 KOhm, +/- 1%, 0.1 W, 0603 (1608 Metric), -55 to 155 degC, RoHS, Tape and Reel; Manufacturer: Panasonic; Max Power Dissipation: 100mW; Voltage Rating: 75V; Temperature Coefficient: 100ppm/degreesC; Datasheet Version: 42095.0; Width: 0.8mm; Mount: SurfaceMount; Radiation Hardening: No; Package URL: http://www.st.com/st-web-ui/static/active/en/resource/technical/document/datasheet/CD00001320.pdf; Depth: 0.8mm; Package Description: 2-Pin Surface Mount Device, Body 1.6 x 0.85 mm; Package Quantity: 1; Contact Plating: Tin; Length: 1.6mm; Max Operating Temperature: 155degC; RoHSCompliant: true; Datasheet URL: https://industrial.panasonic.com/cdbs/www-data/pdf/RDA0000/AOA0000C283.pdf; Height: 0.022inch; Military Standard: Not; Termination: SMD/SMT; Case Code (Metric): 1608; Composition: ThickFilm; Resistance: 3.3KOhm; Packaging: TapeandReel; Min Operating Temperature: -55degC; Case/Package: 0603; Voltage Rating (DC): 75V; Lead Free: LeadFree; Package Reference: 0603; Power Rating: 100mW; Manufacturer URL: http://www.panasonic.com/; Case Code (Imperial): 0603; REACH SVHC: NoSVHC; Number of Terminations: 2; Number of Pins: 2; Tolerance: 1%
T1 = CMP-03913-24618066-1: 750311559 Flyback Converters For For DC/DC Converters SMPS Transformer 1500Vrms Isolation 200 ~ 300kHz Surface; DC Resistance (DCR): 725mΩ; Inductance: 1.5µH; Power Rating: 3W; Height: 8.64mm; NexarPartId: 24618066; Height - Seated (Max): 10.54mm; Frequency: 300kHz; Max Operating Temperature: 125°C; RoHS: Compliant; Lead Free: Lead Free; Length: 9.77mm; Mount: Surface Mount; Width: 9.14mm; Termination: SMD/SMT; Min Operating Temperature: -40°C
U03 = CMP-03913-130378542-1: 1769405241 WPME-FISM Fixed Isolated SIP/SMT Module; Output Power: 2W; Max Output Voltage: 5V; Isolation Voltage: 3kV; Max Input Voltage: 13.2V; Output Current: 400mA; Min Input Voltage: 10.8V; Max Switching Frequency: 600kHz; NexarPartId: 130378542; Length: 13.2mm; Width: 11.4mm; Height: 7.25mm
U04 = CMP-82923-000254-1: SENSOR CURRENT HALL 50A AC/DC; Operating Supply Voltage: 5V; Max Supply Current: 13.5mA; Frequency: 120kHz; Quiescent Current: 10mA; Response Time: 4us; Sensitivity: 40mV/A; Output Current: 1mA; Linearity: 1%; Polarity: Bidirectional; Accuracy: 2%; Number of Channels: 1; Max Supply Voltage: 5.5V; Min Supply Voltage: 3V; Radiation Hardening: No; Packaging: Rail/Tube; Length: 10mm; Height: 7mm; Lead Free: Lead Free; Current Sensing: 50A; Number of Pins: 5; Min Operating Temperature: -40°C; RoHS Compliant: Yes; REACH SVHC: No SVHC; Max Operating Temperature: 150°C; Package Quantity: 34; Bandwidth: 120kHz; Mount: Through Hole; Width: 13mm; Series: -
U05 U13 = CMP-04893-000001-1: IC ISOLATION 8SOIC; Manufacturer: Texas Instruments; Input Offset Voltage: -1.1mV; Standoff Height: 0.36mm; Max Junction Temp: +150°C; Number Of Channels: 1; Input Bias Current: 0.0035uA; Max Supply Voltage: 5.5V; Min Supply Voltage: 3V; Nominal Supply Current: 1.3-7100uA; Temperature Range Low: -55°C; Device Class L3: unset; RoHS: TRUE; Digikey Description: IC ISOLATION 8SOIC; Lead Free: Yes; Device Class L1: Integrated Circuits (ICs); Manufacturer Part Number: AMC1311BDWV; ComponentLink2URL: http://www.ti.com/lit/ds/symlink/amc1311.pdf; Height: 2.8mm; Octopart: https://octopart.com/amc1311bdwv-texas+instruments-88030782; Device Class L2: Linear ICs; Ambient Temperature Range Low: -40°C; Category: IC; Ipc Land Pattern Name: SOIC127P1150X280-8; ComponentLink2Description: Datasheet; Temperature: -55°C to +125°C; Ambient Temperature Range High: +125°C; Automotive: No; Mouser Description: Isolated Amplifier High-Impedance 2V Input Reinforced 3V to 5.5V 8-Pin SOIC Tube; Temperature Range High: +125°C; Package: DWV0008A
U06 = CMP-0758-00079-2: Single Output Low Noise LDO, 150 mA, Fixed 3.3 V Output, 1.5% Tolerance, 2.2 to 16 V Input, Low IQ, 5-Pin SOT-23 (DBV), -40 to 125 degC, Green (RoHS & no Sb/Br), Tape and Reel; Manufacturer: Texas Instruments; Iq (Typ) (mA): 0.85; Fixed Output Options (V): 3.3; Output Options: Fixed Output; Vdo (Typ) (mV): 280; Iout (Max) (A): 0.15; Accuracy (%): 1.5; Packing: Tape and Reel; ComponentLink2URL: http://www.ti.com/lit/ds/symlink/lp2985-50.pdf; ComponentLink2Description: Datasheet; ComponentLink1Description: Manufacturer URL; Operating Temperature Range (degC): -40 to 125; PackageVersion: 4073253-4/L; Vin (V): 2.2 to 16; DatasheetVersion: SLVS522N; PackageReference: DBV0005A; PackageDescription: 5-Pin Plastic Small Outline, Body 2.9 x 1.6 mm, Pitch 0.95 mm; ComponentLink3Description: Package Specification; ComponentLink1URL: http://www.ti.com/; PartNumber: LP2985-33DBVRG4; RoHS: TRUE; ComponentLink3URL: http://www.ti.com/litv/pdf/mpds018j; Mounting Technology: Surface Mount
U07 = CMP-0491-01586-1: Micropower Isolated Flyback Converter with 150 V / 260 mA Switch, 5-pin SOT23 (S5-5), -55 to 150 degC, Pb-Free, Mini Tape and Reel; Manufacturer: Linear Technology; Number of Outputs: 1; PartNumber: LT8300MPS5#TRMPBF; PackageVersion: Jun-10; PackageReference: S5-5; ComponentLink3URL: http://cds.linear.com/docs/en/packaging/SOT_5_05-08-1635.pdf; Packing: Mini Tape and Reel; ComponentLink2Description: Datasheet; RoHS: TRUE; ComponentLink1Description: Manufacturer URL; Mounting Technology: Surface Mount; ComponentLink1URL: http://www.linear.com/; ComponentLink3Description: Package Specification; Code_JEDEC: MO-193; ComponentLink2URL: http://cds.linear.com/docs/en/datasheet/8300f.pdf; PackageDescription: 5-Pin Plastic TSOT-23, Body 1.63 x 2.90 mm, Pitch 0.95 mm
U14 U15 = CMP-0476-00809-1: 50 mA, Low Dropout Micropower Linear Regulator, 3 to 80 V Vin, 5 V Vout, 8-pin SOP (MS8E-8), -40 to 125 degC, Pb-Free; Manufacturer: Linear Technology; Vin Max(V): 80; Iout(mA): 50; Shutdown Current(uA): 1; Dropout Voltage(V): 0.3; Isupply(mA): 0.03; PSRR(dB): 68; Vin Min(V): 3; Discrete Pass Element: no; Output Voltage: 5; Noise(uV): 100; PackageVersion: Rev. F; ComponentLink1URL: http://www.linear.com/; ComponentLink3Description: Package Specification; PackageReference: MS8E-8; RoHS: TRUE; Number of Outputs: 1; ComponentLink3URL: http://cds.linear.com/docs/en/datasheet/3080fc.pdf; ComponentLink2URL: http://cds.linear.com/docs/en/datasheet/30105fe.pdf; PackageDescription: 8-Pin Plastic MSOP, Exposed Die Pad, Body 3 x 3 mm, Pitch 0.65 mm; ComponentLink2Description: Datasheet; PartNumber: LT3010EMS8E-5#PBF; DatasheetVersion: Rev. E; ComponentLink1Description: Manufacturer URL; Mounting Technology: Surface Mount
U16 U17 = CMP-04895-000186-1: IC CMOS 1 CIRCUIT SC70-5; Number of Channels: 1; Input Bias Current: 5pA; Operating Supply Current: 60uA; Gain Bandwidth Product: 1MHz; Slew Rate: 2V/µs; Input Offset Voltage (Vos): 400uV; Output Current per Channel: 40mA; Max Operating Temperature: 125°C; Min Operating Temperature: -40°C; Mount: Surface Mount; RoHS Compliant: Yes; Packaging: Tape and Reel; Number of Circuits: 1

## Sheet Cell_Balancing.SchDoc
size A; SheetNumber: 6; SheetTotal: 9
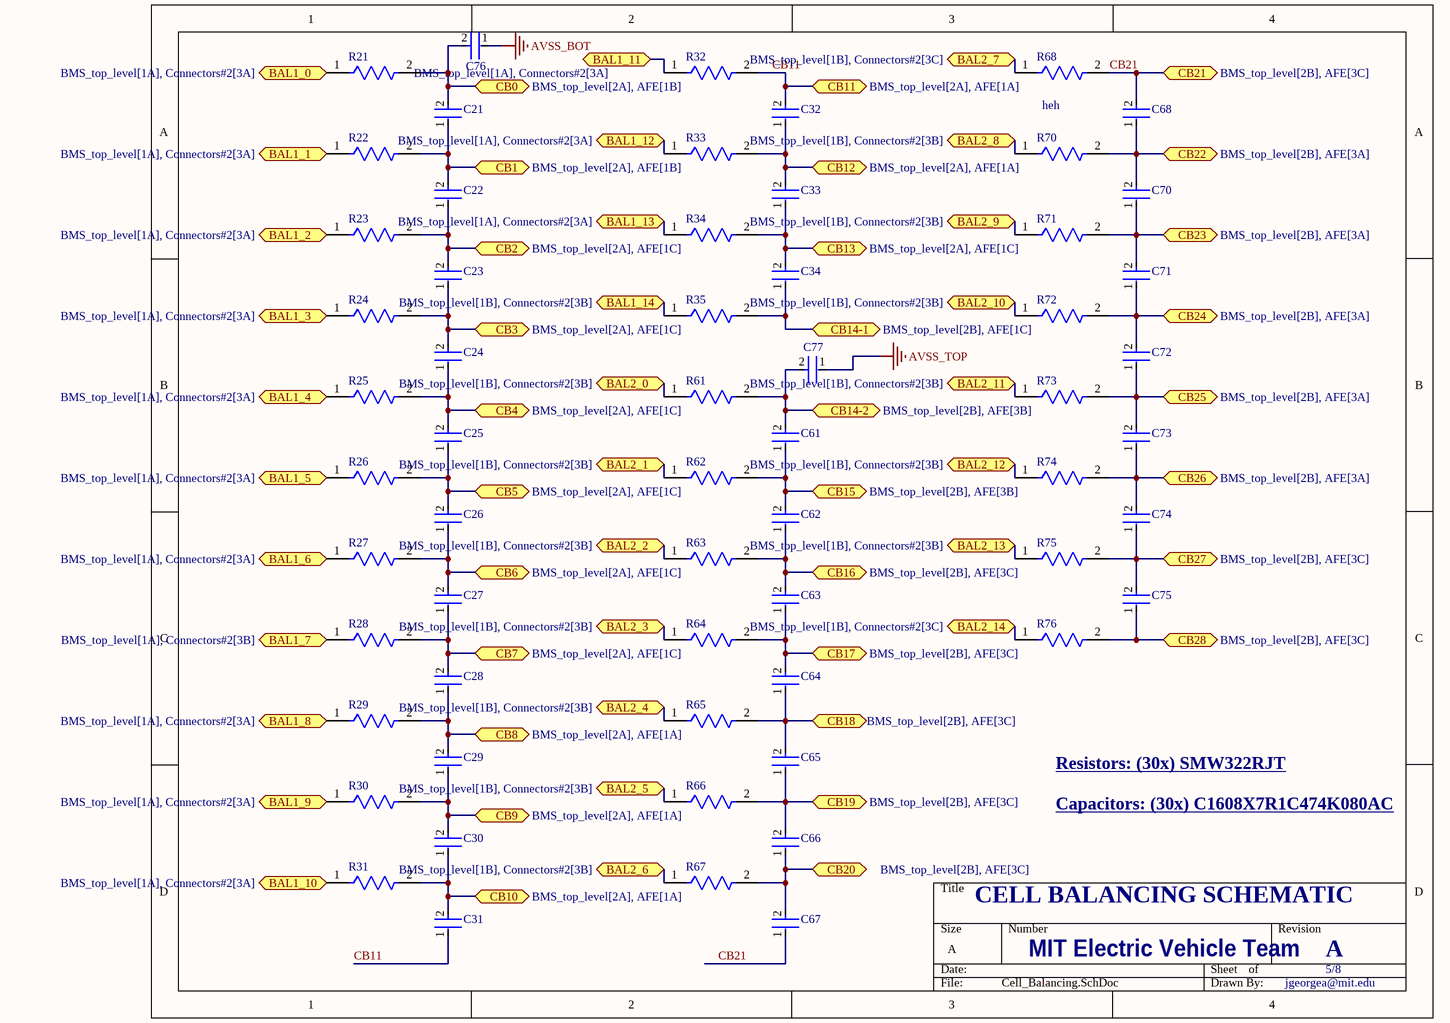
[diagram p6: Cell_Balancing.SchDoc]

### Parts
C21  C1608X7R1C474K080AC  [FP-C1608-080-0_1-IPC_C]  (value not drawn)
C22  C1608X7R1C474K080AC  [FP-C1608-080-0_1-IPC_C]  (value not drawn)
C23  C1608X7R1C474K080AC  [FP-C1608-080-0_1-IPC_C]  (value not drawn)
C24  C1608X7R1C474K080AC  [FP-C1608-080-0_1-IPC_C]  (value not drawn)
C25  C1608X7R1C474K080AC  [FP-C1608-080-0_1-IPC_C]  (value not drawn)
C26  C1608X7R1C474K080AC  [FP-C1608-080-0_1-IPC_C]  (value not drawn)
C27  C1608X7R1C474K080AC  [FP-C1608-080-0_1-IPC_C]  (value not drawn)
C28  C1608X7R1C474K080AC  [FP-C1608-080-0_1-IPC_C]  (value not drawn)
C29  C1608X7R1C474K080AC  [FP-C1608-080-0_1-IPC_C]  (value not drawn)
C30  C1608X7R1C474K080AC  [FP-C1608-080-0_1-IPC_C]  (value not drawn)
C31  C1608X7R1C474K080AC  [FP-C1608-080-0_1-IPC_C]  (value not drawn)
C32  C1608X7R1C474K080AC  [FP-C1608-080-0_1-IPC_C]  (value not drawn)
C33  C1608X7R1C474K080AC  [FP-C1608-080-0_1-IPC_C]  (value not drawn)
C34  C1608X7R1C474K080AC  [FP-C1608-080-0_1-IPC_C]  (value not drawn)
C61  C1608X7R1C474K080AC  [FP-C1608-080-0_1-IPC_C]  (value not drawn)
C62  C1608X7R1C474K080AC  [FP-C1608-080-0_1-IPC_C]  (value not drawn)
C63  C1608X7R1C474K080AC  [FP-C1608-080-0_1-IPC_C]  (value not drawn)
C64  C1608X7R1C474K080AC  [FP-C1608-080-0_1-IPC_C]  (value not drawn)
C65  C1608X7R1C474K080AC  [FP-C1608-080-0_1-IPC_C]  (value not drawn)
C66  C1608X7R1C474K080AC  [FP-C1608-080-0_1-IPC_C]  (value not drawn)
C67  C1608X7R1C474K080AC  [FP-C1608-080-0_1-IPC_C]  (value not drawn)
C68  C1608X7R1C474K080AC  [FP-C1608-080-0_1-IPC_C]  (value not drawn)
C70  C1608X7R1C474K080AC  [FP-C1608-080-0_1-IPC_C]  (value not drawn)
C71  C1608X7R1C474K080AC  [FP-C1608-080-0_1-IPC_C]  (value not drawn)
C72  C1608X7R1C474K080AC  [FP-C1608-080-0_1-IPC_C]  (value not drawn)
C73  C1608X7R1C474K080AC  [FP-C1608-080-0_1-IPC_C]  (value not drawn)
C74  C1608X7R1C474K080AC  [FP-C1608-080-0_1-IPC_C]  (value not drawn)
C75  C1608X7R1C474K080AC  [FP-C1608-080-0_1-IPC_C]  (value not drawn)
C76  C1608X7R1C474K080AC  [FP-C1608-080-0_1-IPC_C]  (value not drawn)
C77  C1608X7R1C474K080AC  [FP-C1608-080-0_1-IPC_C]  (value not drawn)
R21  SMW322RJT  [FP-SM_3-MFG]  (value not drawn)
R22  SMW322RJT  [FP-SM_3-MFG]  (value not drawn)
R23  SMW322RJT  [FP-SM_3-MFG]  (value not drawn)
R24  SMW322RJT  [FP-SM_3-MFG]  (value not drawn)
R25  SMW322RJT  [FP-SM_3-MFG]  (value not drawn)
R26  SMW322RJT  [FP-SM_3-MFG]  (value not drawn)
R27  SMW322RJT  [FP-SM_3-MFG]  (value not drawn)
R28  SMW322RJT  [FP-SM_3-MFG]  (value not drawn)
R29  SMW322RJT  [FP-SM_3-MFG]  (value not drawn)
R30  SMW322RJT  [FP-SM_3-MFG]  (value not drawn)
R31  SMW322RJT  [FP-SM_3-MFG]  (value not drawn)
R32  SMW322RJT  [FP-SM_3-MFG]  (value not drawn)
R33  SMW322RJT  [FP-SM_3-MFG]  (value not drawn)
R34  SMW322RJT  [FP-SM_3-MFG]  (value not drawn)
R35  SMW322RJT  [FP-SM_3-MFG]  (value not drawn)
R61  SMW322RJT  [FP-SM_3-MFG]  (value not drawn)
R62  SMW322RJT  [FP-SM_3-MFG]  (value not drawn)
R63  SMW322RJT  [FP-SM_3-MFG]  (value not drawn)
R64  SMW322RJT  [FP-SM_3-MFG]  (value not drawn)
R65  SMW322RJT  [FP-SM_3-MFG]  (value not drawn)
R66  SMW322RJT  [FP-SM_3-MFG]  (value not drawn)
R67  SMW322RJT  [FP-SM_3-MFG]  (value not drawn)
R68  SMW322RJT  [FP-SM_3-MFG]  (value not drawn)
R70  SMW322RJT  [FP-SM_3-MFG]  (value not drawn)
R71  SMW322RJT  [FP-SM_3-MFG]  (value not drawn)
R72  SMW322RJT  [FP-SM_3-MFG]  (value not drawn)
R73  SMW322RJT  [FP-SM_3-MFG]  (value not drawn)
R74  SMW322RJT  [FP-SM_3-MFG]  (value not drawn)
R75  SMW322RJT  [FP-SM_3-MFG]  (value not drawn)
R76  SMW322RJT  [FP-SM_3-MFG]  (value not drawn)

### Ports
BAL1_0 (bidir, see BMS_top_level[1A], Connectors#2[3A]), BAL1_1 (bidir, see BMS_top_level[1A], Connectors#2[3A]), BAL1_2 (bidir, see BMS_top_level[1A], Connectors#2[3A]), BAL1_3 (bidir, see BMS_top_level[1A], Connectors#2[3A]), BAL1_4 (bidir, see BMS_top_level[1A], Connectors#2[3A]), BAL1_5 (bidir, see BMS_top_level[1A], Connectors#2[3A]), BAL1_6 (bidir, see BMS_top_level[1A], Connectors#2[3A]), BAL1_7 (bidir, see BMS_top_level[1A], Connectors#2[3B]), BAL1_8 (bidir, see BMS_top_level[1A], Connectors#2[3A]), BAL1_9 (bidir, see BMS_top_level[1A], Connectors#2[3A]), BAL1_10 (bidir, see BMS_top_level[1A], Connectors#2[3A]), BAL1_11 (bidir, see BMS_top_level[1A], Connectors#2[3A]), BAL1_12 (bidir, see BMS_top_level[1A], Connectors#2[3A]), BAL1_13 (bidir, see BMS_top_level[1A], Connectors#2[3A]), BAL1_14 (bidir, see BMS_top_level[1B], Connectors#2[3B]), BAL2_0 (bidir, see BMS_top_level[1B], Connectors#2[3B]), BAL2_1 (bidir, see BMS_top_level[1B], Connectors#2[3B]), BAL2_2 (bidir, see BMS_top_level[1B], Connectors#2[3B]), BAL2_3 (bidir, see BMS_top_level[1B], Connectors#2[3B]), BAL2_4 (bidir, see BMS_top_level[1B], Connectors#2[3B]), BAL2_5 (bidir, see BMS_top_level[1B], Connectors#2[3B]), BAL2_6 (bidir, see BMS_top_level[1B], Connectors#2[3B]), BAL2_7 (bidir, see BMS_top_level[1B], Connectors#2[3C]), BAL2_8 (bidir, see BMS_top_level[1B], Connectors#2[3B]), BAL2_9 (bidir, see BMS_top_level[1B], Connectors#2[3B]), BAL2_10 (bidir, see BMS_top_level[1B], Connectors#2[3B]), BAL2_11 (bidir, see BMS_top_level[1B], Connectors#2[3B]), BAL2_12 (bidir, see BMS_top_level[1B], Connectors#2[3B]), BAL2_13 (bidir, see BMS_top_level[1B], Connectors#2[3B]), BAL2_14 (bidir, see BMS_top_level[1B], Connectors#2[3C]), CB0 (bidir, see BMS_top_level[2A], AFE[1B]), CB1 (bidir, see BMS_top_level[2A], AFE[1B]), CB2 (bidir, see BMS_top_level[2A], AFE[1C]), CB3 (bidir, see BMS_top_level[2A], AFE[1C]), CB4 (bidir, see BMS_top_level[2A], AFE[1C]), CB5 (bidir, see BMS_top_level[2A], AFE[1C]), CB6 (bidir, see BMS_top_level[2A], AFE[1C]), CB7 (bidir, see BMS_top_level[2A], AFE[1C]), CB8 (bidir, see BMS_top_level[2A], AFE[1A]), CB9 (bidir, see BMS_top_level[2A], AFE[1A]), CB10 (bidir, see BMS_top_level[2A], AFE[1A]), CB11 (bidir, see BMS_top_level[2A], AFE[1A]), CB12 (bidir, see BMS_top_level[2A], AFE[1A]), CB13 (bidir, see BMS_top_level[2A], AFE[1C]), CB14-1 (bidir, see BMS_top_level[2B], AFE[1C]), CB14-2 (bidir, see BMS_top_level[2B], AFE[3B]), CB15 (bidir, see BMS_top_level[2B], AFE[3B]), CB16 (bidir, see BMS_top_level[2B], AFE[3C]), CB17 (bidir, see BMS_top_level[2B], AFE[3C]), CB18 (bidir, see BMS_top_level[2B], AFE[3C]), CB19 (bidir, see BMS_top_level[2B], AFE[3C]), CB20 (bidir, see BMS_top_level[2B], AFE[3C]), CB21 (bidir, see BMS_top_level[2B], AFE[3C]), CB22 (bidir, see BMS_top_level[2B], AFE[3A]), CB23 (bidir, see BMS_top_level[2B], AFE[3A]), CB24 (bidir, see BMS_top_level[2B], AFE[3A]), CB25 (bidir, see BMS_top_level[2B], AFE[3A]), CB26 (bidir, see BMS_top_level[2B], AFE[3A]), CB27 (bidir, see BMS_top_level[2B], AFE[3C]), CB28 (bidir, see BMS_top_level[2B], AFE[3C])

### Nets
AVSS_BOT: C76.1
AVSS_TOP: C77.1
CB11: C31.1 C32.2 R32.2 ; port CB11
CB21: C67.1 C68.2 R68.2 ; port CB21
NetC21_1: C21.1 C22.2 R22.2 ; port CB1
NetC21_2: C21.2 C76.2 R21.2 ; port CB0
NetC22_1: C22.1 C23.2 R23.2 ; port CB2
NetC23_1: C23.1 C24.2 R24.2 ; port CB3
NetC24_1: C24.1 C25.2 R25.2 ; port CB4
NetC25_1: C25.1 C26.2 R26.2 ; port CB5
NetC26_1: C26.1 C27.2 R27.2 ; port CB6
NetC27_1: C27.1 C28.2 R28.2 ; port CB7
NetC28_1: C28.1 C29.2 R29.2 ; port CB8
NetC29_1: C29.1 C30.2 R30.2 ; port CB9
NetC30_1: C30.1 C31.2 R31.2 ; port CB10
NetC32_1: C32.1 C33.2 R33.2 ; port CB12
NetC33_1: C33.1 C34.2 R34.2 ; port CB13
NetC34_1: C34.1 R35.2 ; port CB14-1
NetC61_1: C61.1 C62.2 R62.2 ; port CB15
NetC61_2: C61.2 C77.2 R61.2 ; port CB14-2
NetC62_1: C62.1 C63.2 R63.2 ; port CB16
NetC63_1: C63.1 C64.2 R64.2 ; port CB17
NetC64_1: C64.1 C65.2 R65.2 ; port CB18
NetC65_1: C65.1 C66.2 R66.2 ; port CB19
NetC66_1: C66.1 C67.2 R67.2 ; port CB20
NetC68_1: C68.1 C70.2 R70.2 ; port CB22
NetC70_1: C70.1 C71.2 R71.2 ; port CB23
NetC71_1: C71.1 C72.2 R72.2 ; port CB24
NetC72_1: C72.1 C73.2 R73.2 ; port CB25
NetC73_1: C73.1 C74.2 R74.2 ; port CB26
NetC74_1: C74.1 C75.2 R75.2 ; port CB27
NetC75_1: C75.1 R76.2 ; port CB28
NetJ4_1: R21.1 ; port BAL1_0
NetJ4_2: R22.1 ; port BAL1_1
NetJ4_3: R23.1 ; port BAL1_2
NetJ4_4: R24.1 ; port BAL1_3
NetJ4_5: R25.1 ; port BAL1_4
NetJ4_6: R26.1 ; port BAL1_5
NetJ4_7: R27.1 ; port BAL1_6
NetJ4_8: R28.1 ; port BAL1_7
NetJ4_9: R29.1 ; port BAL1_8
NetJ4_10: R30.1 ; port BAL1_9
NetJ4_11: R31.1 ; port BAL1_10
NetJ4_12: R32.1 ; port BAL1_11
NetJ4_13: R33.1 ; port BAL1_12
NetJ4_14: R34.1 ; port BAL1_13
NetJ4_15: R35.1 ; port BAL1_14
NetJ5_1: R61.1 ; port BAL2_0
NetJ5_2: R62.1 ; port BAL2_1
NetJ5_3: R63.1 ; port BAL2_2
NetJ5_4: R64.1 ; port BAL2_3
NetJ5_5: R65.1 ; port BAL2_4
NetJ5_6: R66.1 ; port BAL2_5
NetJ5_7: R67.1 ; port BAL2_6
NetJ5_8: R68.1 ; port BAL2_7
NetJ5_9: R70.1 ; port BAL2_8
NetJ5_10: R71.1 ; port BAL2_9
NetJ5_11: R72.1 ; port BAL2_10
NetJ5_12: R73.1 ; port BAL2_11
NetJ5_13: R74.1 ; port BAL2_12
NetJ5_14: R75.1 ; port BAL2_13
NetJ5_15: R76.1 ; port BAL2_14

### Notes on the sheet
- heh
- Resistors: (30x) SMW322RJT
- Capacitors: (30x) C1608X7R1C474K080AC
- CELL BALANCING SCHEMATIC
- MIT Electric Vehicle Team
- A
- 5/8
- jgeorgea@mit.edu

### Library data of the parts
C21-C34 C61-C68 C70-C77 = CMP-08246-006173-1: Multilayer Ceramic Capacitors 470nF ±10% 16V X7R SMD 0603; REACH SVHC: No SVHC; Number of Pins: 2; Thickness: 0.037inch; Lead Free: Lead Free; Voltage: 16V; Case Code (Imperial): 0603; Capacitance: 470nF; Length: 1.6mm; Dielectric: X7R; Resistor Type: Ceramic; Weight: 7.1E-05oz; Termination: SMD/SMT; Radiation Hardening: No; RoHS Compliant: Yes; Dielectric Material: Ceramic; Case Code (Metric): 1608; Construction: Flat; Voltage Rating (DC): 16V; Package Quantity: 1; Mount: Surface Mount; Min Operating Temperature: -55°C; Case/Package: 0603; Series: C; Max Operating Temperature: 125°C; Depth: 0.8mm; Voltage Rating: 16V; Width: 0.031inch; Tolerance: 10%; Height: 0.8mm; Packaging: Tape and Reel
R21-R35 R61-R68 R70-R76 = CMP-03211-006031-1: RES SMD 22 OHM 5% 3W 4122; Manufacturer: TE connectivity; Resistance: 22Ω; Temperature Coefficient: 200ppm/°C; Value: 22Ω; Voltage Rating: 500V; Tolerance: 5%; Lead Free: Yes; Series: SM; ComponentLink2Description: Datasheet; Mouser Description: Wirewound Resistors - SMD 22    OHM  5%   3W; Device Class L3: Chip SMD Resistors; Device Class L1: Passive Components; Octopart: https://octopart.com/smw322rjt-te+connectivity-40971089; Device Class L2: Resistors; Height: 5.3mm; Automotive: No; Manufacturer Part Number: SMW322RJT; Power Rating: 3W; Temperature: -55°C to +200°C; Package: SM_3; Category: Res; RoHS: TRUE; Temperature Range High: +200°C; Temperature Range Low: -55°C; Digikey Description: RES SMD 22 OHM 5% 3W 4122; ComponentLink2URL: https://www.te.com/commerce/DocumentDelivery/DDEController?Action=showdoc&DocId=Data+Sheet%7F1773242%7FE%7Fpdf%7FEnglish%7FENG_DS_1773242_E.pdf%7F5-1879021-7; Composition: Wirewound